# Altium schematic sheet encoder.SchDoc
size A4; SheetNumber: 7; SheetTotal: 8
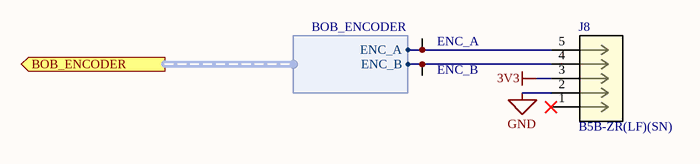
[diagram p0: encoder.SchDoc]

## Parts
ENC_A  Test Point (Via)  [TP]  (value not drawn)
ENC_B  Test Point (Via)  [TP]  (value not drawn)
J8  B5B-ZR(LF)(SN)  [JST_B5B-ZR(LF)(SN)]

## Ports
BOB_ENCODER (out, harness BOB_ENCODER)

## Harnesses
BOB_ENCODER: ENC_A, ENC_B

## Nets
3V3: J8.3
GND: J8.2
NetENC_A_1: ENC_A.1 J8.5 ; port BOB_ENCODER.ENC_A
NetENC_B_1: ENC_B.1 J8.4 ; port BOB_ENCODER.ENC_B

Not connected (* = marked no-connect by the designer): J8 1*

## Library data of the parts
J8 = CN 5POS JST ZR: Connector Header Through Hole 5 position 0.059 (1.50mm); MF: JST Sales; Package: None; Check_prices: https://www.snapeda.com/parts/B5B-ZR(LF)(SN)/JST%20Sales%20America%20Inc./view-part/214617/?ref=eda; Purchase-URL: https://pricing.snapeda.com/search/part/B5B-ZR(LF)(SN)/?ref=eda; Price: None; MP: B5B-ZR(LF)(SN); Value: *; Availability: Warning; SnapEDA_Link: https://www.snapeda.com/parts/B5B-ZR(LF)(SN)/JST%20Sales%20America%20Inc./view-part/214617/?ref=snap; Supplier 1: Digi-Key; Supplier 2: Future Electronics; Supplier Part Number 1: 455-1660-ND; Supplier Part Number 2: 5800651